# EasyEDA Pro project SMPS_V1.epro, schematic Schematic3
Board Name: INPUT; Create Date: 2026-02-11; Page Name: P1; Project Name: TL494-PSU-V1; Schematic Name: Schematic3; Update Date: 2026-02-11; Company: EasyEDA.com; Page Size: A4; Version: V1.0
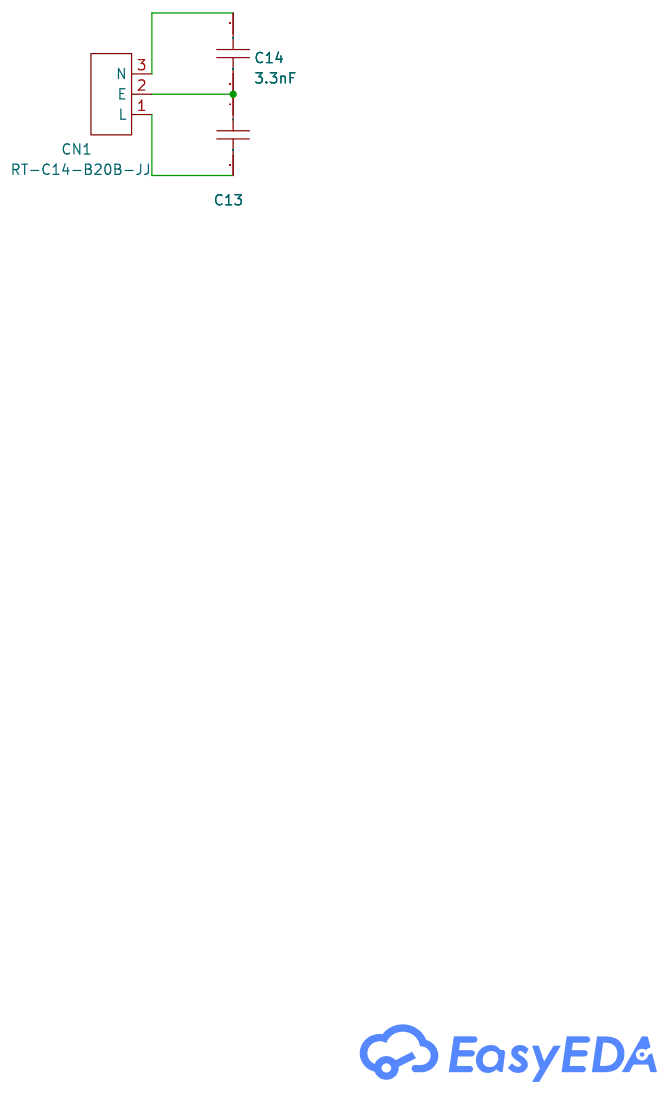
[diagram p11: schematic sheet]

## Parts
C13  3.3nF  [CAP-TH_L10.0-W4.4-P10.00-S3.8-D0.6]
C14  3.3nF  [CAP-TH_L10.0-W4.4-P10.00-S3.8-D0.6]
CN1  RT-C14-B20B-JJ  [AC-IN-TH_LEGION_RT-C14-B20B-JJ]

## Library data of the parts
C13 C14 = CY1332ME1IEF48O2A2: Capacitance:3.3nF Tolerance:±20% Tolerance:±20% Voltage(AC):400V Ratings:Y1 safety certification:CQC；CUL；UL；ENEC；VDE Operating Temperature:-40℃~+125℃ Operating Temperature:-40℃~+125℃; LCSC Part Name: 等级:Y1 3300pF ±20% 400V; Supplier Part: C2761711; Manufacturer: Dersonic(德尔创); Supplier Footprint: 插件,P=10mm; JLCPCB Part Class: Extended Part; Datasheet: https://item.szlcsc.com/datasheet/CY1332ME1IEF48O2A2/2886458.html; Supplier: LCSC; Tolerance: ±20%; Voltage(AC): 400V; Ratings: Y1; safety certification: CQC；CUL；UL；ENEC；VDE; Operating Temperature: -40℃~+125℃
CN1 = RT-C14-B20B-JJ: Standard:IEC 320-C14 Number of Ports:1 PIN Number Per Port:3 Mounting Style:Right-Angle Current Rating (Max):15A Rated Voltage (Max):250V Supplementary Features:- Operating Temperature Range:- Operating Temperature Range:-; Supplier Part: C19190834; Manufacturer: Legion(六钧); Supplier Footprint: 插件; JLCPCB Part Class: Extended Part; Datasheet: https://atta.szlcsc.com/upload/public/pdf/source/20231110/74D7F96B63247F0701E9233320C7B445.pdf; Supplier: LCSC; Standard: IEC 320-C14; Number of Ports: 1; PIN Number Per Port: 3; Mounting Style: Right-Angle; Current Rating (Max): 15A; Rated Voltage (Max): 250V

## Nets
$1N226: C13.1 C14.2 CN1.2(E)
$1N230: C13.2 CN1.1(L)
$1N243: C14.1 CN1.3(N)
